# Altium schematic sheet CATS-GS-MCU.SchDoc: CATS Groundstation
size A4; DocumentNumber: Overview; Revision: V1.0; SheetNumber: 3; SheetTotal: 9; Author: Luca Jost; Subtitle: Microcontroller
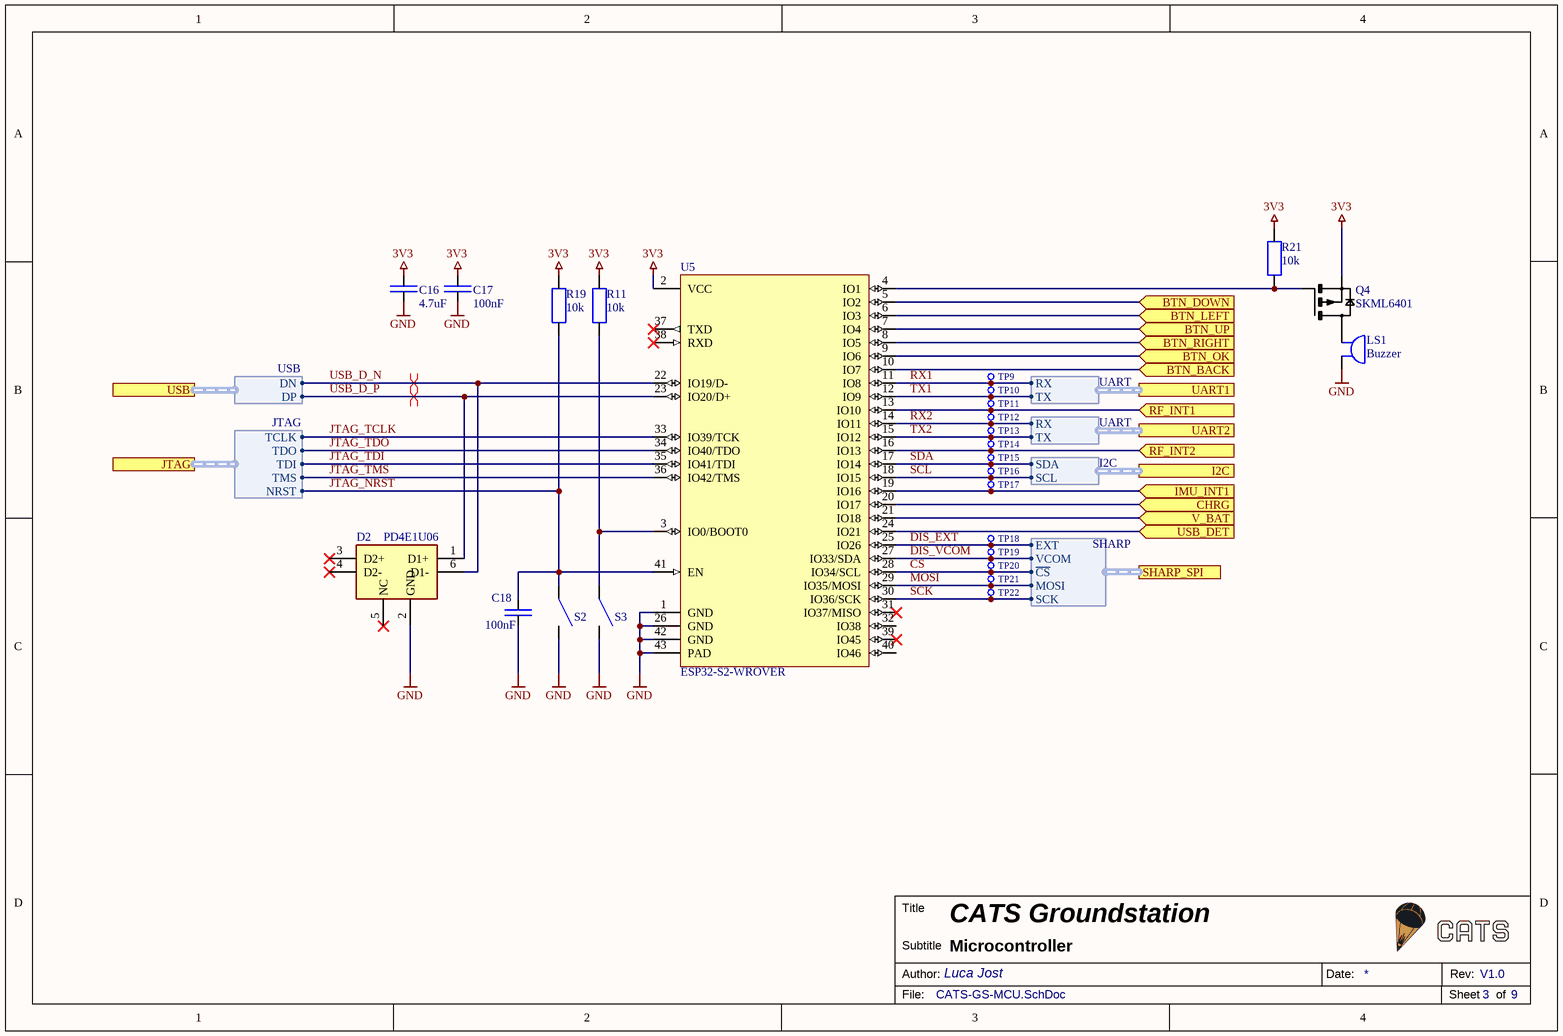
[diagram p0: CATS-GS-MCU.SchDoc]

## Parts
C16  4.7uF  [SMD Keramikkondensator 0402]
C17  100nF  [SMD Keramikkondensator 0402]
C18  100nF  [SMD Keramikkondensator 0402]
D2  PD4E1U06  [SMD IC SOT-363 (SC-70-6)]
LS1  Buzzer  [SMD BUZZER CMT-8504]
Q4  SKML6401  [SMD MOSFET SOT-23]
R11  10k  [SMD Widerstand 0402]
R19  10k  [SMD Widerstand 0402]
R21  10k  [SMD Widerstand 0402]
S2  SMD-Button  [SMD Button 2.5x3x1.2]  (value not drawn)
S3  SMD-Button  [SMD Button 2.5x3x1.2]  (value not drawn)
TP9  X-TP  [SMD Testpoint 1mm]  (value not drawn)  (no BOM)
TP10  X-TP  [SMD Testpoint 1mm]  (value not drawn)  (no BOM)
TP11  X-TP  [SMD Testpoint 1mm]  (value not drawn)  (no BOM)
TP12  X-TP  [SMD Testpoint 1mm]  (value not drawn)  (no BOM)
TP13  X-TP  [SMD Testpoint 1mm]  (value not drawn)  (no BOM)
TP14  X-TP  [SMD Testpoint 1mm]  (value not drawn)  (no BOM)
TP15  X-TP  [SMD Testpoint 1mm]  (value not drawn)  (no BOM)
TP16  X-TP  [SMD Testpoint 1mm]  (value not drawn)  (no BOM)
TP17  X-TP  [SMD Testpoint 1mm]  (value not drawn)  (no BOM)
TP18  X-TP  [SMD Testpoint 1mm]  (value not drawn)  (no BOM)
TP19  X-TP  [SMD Testpoint 1mm]  (value not drawn)  (no BOM)
TP20  X-TP  [SMD Testpoint 1mm]  (value not drawn)  (no BOM)
TP21  X-TP  [SMD Testpoint 1mm]  (value not drawn)  (no BOM)
TP22  X-TP  [SMD Testpoint 1mm]  (value not drawn)  (no BOM)
U5  ESP32-S2-WROVER  [SMD ESP32-S2-WROOM]

## Ports
BTN_BACK (in), BTN_DOWN (in), BTN_LEFT (in), BTN_OK (in), BTN_RIGHT (in), BTN_UP (in), CHRG (in), I2C (harness I2C), IMU_INT1 (in), JTAG (harness JTAG), RF_INT1 (in), RF_INT2 (in), SHARP_SPI (harness SHARP), UART1 (harness UART), UART2 (harness UART), USB (harness USB), USB_DET (in), V_BAT (in)

## Harnesses
SHARP: MOSI, ~{CS}, SCK, VCOM, EXT
USB: DP, DN
JTAG: TMS, TDI, TDO, TCLK, NRST
UART: RX, TX
I2C: SDA, SCL

## Nets
3V3: C16.2 C17.2 Q4.S R11.2 R19.2 R21.2 U5.2(VCC)
GND: C16.1 C17.1 C18.1 D2.2(GND) LS1.2 S2.2 S3.2 U5.1(GND) U5.26(GND) U5.42(GND) U5.43(PAD)
BTN_BACK: U5.10(IO7) ; port BTN_BACK
BTN_DOWN: U5.5(IO2) ; port BTN_DOWN
BTN_LEFT: U5.6(IO3) ; port BTN_LEFT
BTN_OK: U5.9(IO6) ; port BTN_OK
BTN_RIGHT: U5.8(IO5) ; port BTN_RIGHT
BTN_UP: U5.7(IO4) ; port BTN_UP
~{CS}: TP20.1 U5.28(IO34/SCL) ; port SHARP_SPI.~{CS}
CHRG: U5.20(IO17) ; port CHRG
DIS_EXT: TP18.1 U5.25(IO26) ; port SHARP_SPI.EXT
DIS_VCOM: TP19.1 U5.27(IO33/SDA) ; port SHARP_SPI.VCOM
IMU_INT1: TP17.1 U5.19(IO16) ; port IMU_INT1
JTAG_NRST: C18.2 R19.1 S2.1 U5.41(EN) ; port JTAG.NRST
JTAG_TCLK: U5.33(IO39/TCK) ; port JTAG.TCLK
JTAG_TDI: U5.35(IO41/TDI) ; port JTAG.TDI
JTAG_TDO: U5.34(IO40/TDO) ; port JTAG.TDO
JTAG_TMS: U5.36(IO42/TMS) ; port JTAG.TMS
MOSI: TP21.1 U5.29(IO35/MOSI) ; port SHARP_SPI.MOSI
RF_INT1: TP11.1 U5.13(IO10) ; port RF_INT1
RF_INT2: TP14.1 U5.16(IO13) ; port RF_INT2
RX1: TP9.1 U5.11(IO8) ; port UART1.RX
RX2: TP12.1 U5.14(IO11) ; port UART2.RX
SCK: TP22.1 U5.30(IO36/SCK) ; port SHARP_SPI.SCK
SCL: TP16.1 U5.18(IO15) ; port I2C.SCL
SDA: TP15.1 U5.17(IO14) ; port I2C.SDA
TX1: TP10.1 U5.12(IO9) ; port UART1.TX
TX2: TP13.1 U5.15(IO12) ; port UART2.TX
USB_D_N: D2.6(D1-) U5.22(IO19/D-) ; port USB.DN
USB_D_P: D2.1(D1+) U5.23(IO20/D+) ; port USB.DP
USB_DET: U5.24(IO21) ; port USB_DET
V_BAT: U5.21(IO18) ; port V_BAT
NetLS1_1: LS1.1 Q4.D
NetQ4_G: Q4.G R21.1 U5.4(IO1)
NetR11_1: R11.1 S3.1 U5.3(IO0/BOOT0)

Not connected (* = marked no-connect by the designer): D2 3(D2+)* 4(D2-)* 5(NC)*; U5 31(IO37/MISO)* 32(IO38) 37(TXD)* 38(RXD)* 39(IO45)* 40(IO46)

## Layout directives
differential pair: USB_D_N, USB_D_P

## Notes on the sheet
- Title
- Author:
- Subtitle
- Date:
- Rev:
- File:
- Sheet
- of

## Library data of the parts
C16 = E6 - 4.7uF: SMD Ceramic Capacitor E6; Unit Price: 0.01; Number: -; Supplier: -; JLC: C23733
C17 C18 = E6 - 100nF: SMD Ceramic Capacitor E6; Unit Price: 0.01; Number: -; Supplier: -; JLC: C307331
D2 = PD4E1U06DCKR: Unidirectional 3A (8/20us) 15V (Typ) 6.5V 5.5V (Max) SOT-363 ESD Protection Devices ROHS; Component Description: ESD Suppressor; ComponentLink1Description: Datasheet; ComponentLink1URL: https://datasheet.lcsc.com/lcsc/1810172210_Texas-Instruments-TPD4E1U06DCKR_C194628.pdf; Component Value: PD4E1U06; Digikey: 296-39347-1-ND; Farnell: 3116516; Mouser: 595-TPD4E1U06DCKR; Unit Price: 0.12; JLC: C194628
LS1 = Buzzer: Buzzers Indicator, Internally Driven Piezo 12V 10mA 3kHz 100dB @ 12V, 10cm Through Hole PC Pins; Digikey: 2603-CT08E-06S300-2TR-ND; ComponentLink1Description: Datasheet; ComponentLink1URL: https://datasheet.lcsc.com/lcsc/2001061407_INGHAi-GSC8530RA-16R2700_C255315.pdf; JLC: C255315; Unit Price: 0.4057
Q4 = SKML6401: P Channel MOSFET, 16V 3A, SOT-23; JLC: C475708; ComponentLink1Description: Datasheet; ComponentLink1URL: https://datasheet.lcsc.com/lcsc/2001131004_Shikues-SKML6401_C475708.pdf
R11 R19 R21 = E24 - 10k: SMD Chip Resistor E24; Unit Price: 0.01; Number: -; Supplier: -; JLC: C25744
S2 S3 = Button 3mmx2.5mm: Button SPST; Digikey: SW1020TR-ND; JLC: C128937
TP9-TP22 = X-TP: Testpunkt; Component Value: Ø 0.8mm; Component Description: Testpoint; Unit Price: 0.00
U5 = ESP32-S2-WROVER: WiFi 802.11b/g/n Transceiver Module 2.4GHz Antenna, Surface Mount; ComponentLink1Description: Datasheet; ComponentLink1URL: https://www.espressif.com/sites/default/files/documentation/esp32-s2-wroom_esp32-s2-wroom-i_datasheet_en.pdf; JLC: C701333; Digikey: 1965-ESP32-S2-WROOMTR-ND